# Altium schematic sheet Test_Board_Sch.SchDoc
size A4; SheetNumber: 1; SheetTotal: 1
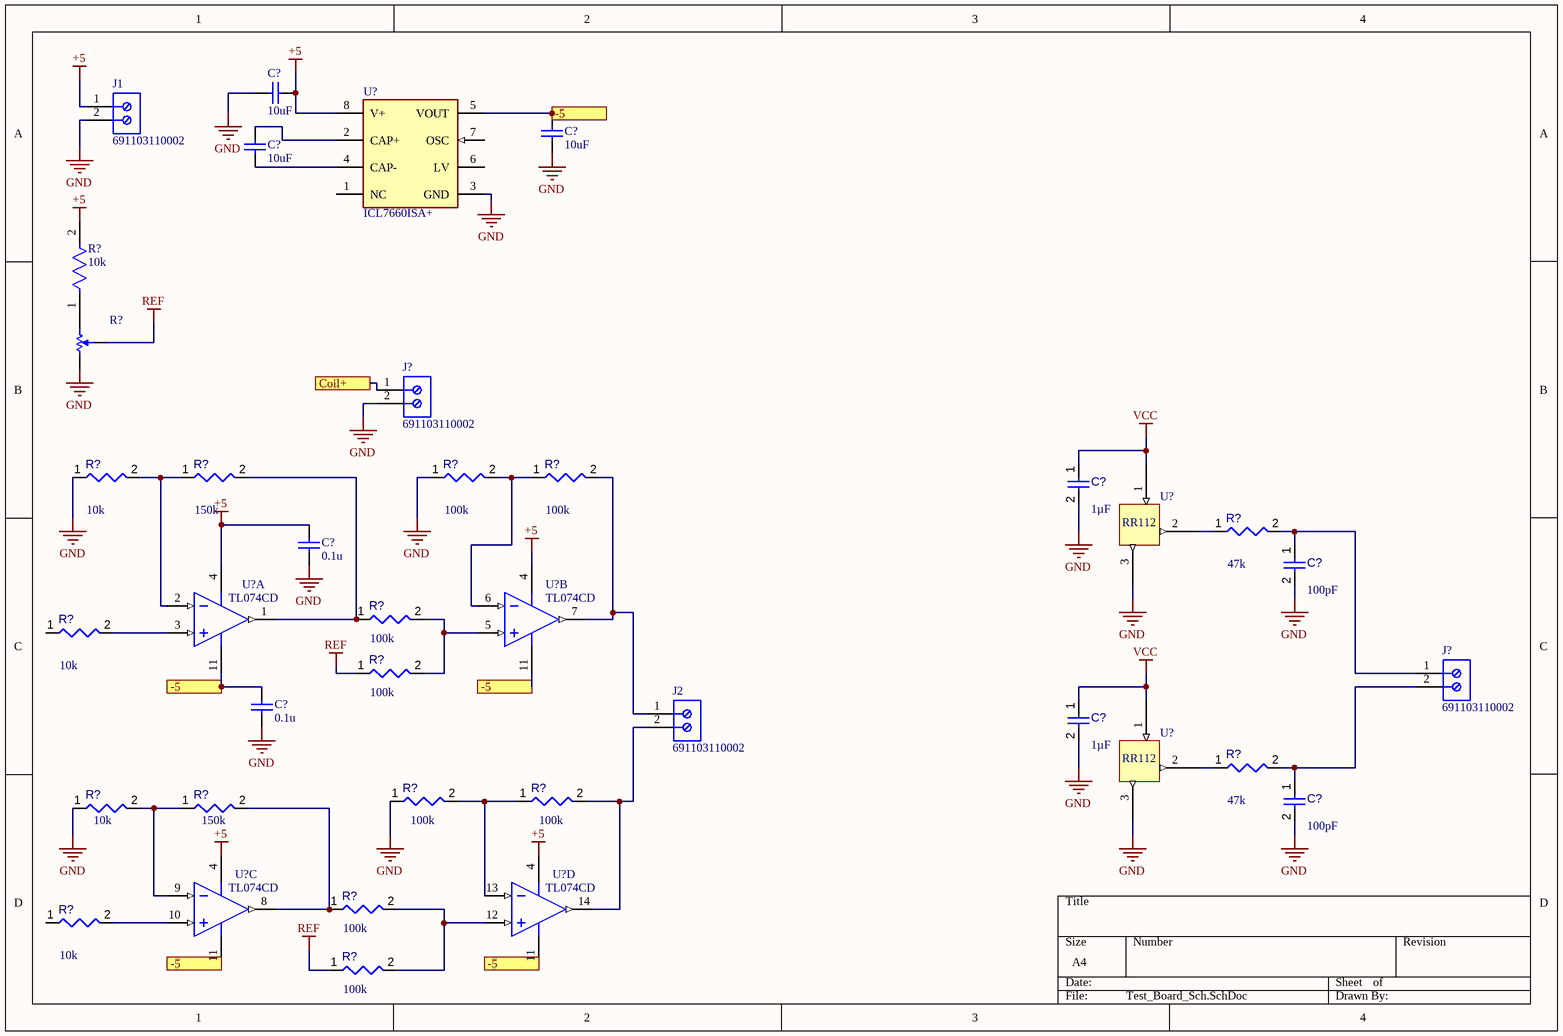
[diagram p0: Test_Board_Sch.SchDoc]

## Parts
(Parts that share a designator on the sheet are numbered #1, #2 ... from top to bottom, then left to right.)
C?#1  10uF  [CAPC2013X88X50LL20T25]
C?#2  10uF  [CAPC2013X88X50LL20T25]
C?#3  10uF  [CAPC2013X88X50LL20T25]
C?#4  value 1µF  [CAPC2013X145X50ML20T25]  (hidden comment: Capacitor 1 uF +/- 10% 25 V 0805)
C?#5  value 100pF  [CAPC2013X145X50ML20T25]  (hidden comment: Capacitor 1 uF +/- 10% 25 V 0805)
C?#6  0.1u  [CAPC2013X88X50LL20T25]
C?#7  value 1µF  [CAPC2013X145X50ML20T25]  (hidden comment: Capacitor 1 uF +/- 10% 25 V 0805)
C?#8  0.1u  [CAPC2013X88X50LL20T25]
C?#9  value 100pF  [CAPC2013X145X50ML20T25]  (hidden comment: Capacitor 1 uF +/- 10% 25 V 0805)
J1  691103110002  [691103110002]
J2  691103110002  [691103110002]
J?#1  691103110002  [691103110002]
J?#2  691103110002  [691103110002]
R?#1  10k  [FP-CR0805-IPC_B]
R?#2  TC33X-2-103E  [BOUR-TC33X-2_V]  (value not drawn)
R?#3  value 10k  [RESC2013X70X40ML20T20]  (hidden comment: Resistor 4k7 +/-1% 0805 125 mW)
R?#4  value 150k  [RESC2013X70X40ML20T20]  (hidden comment: Resistor 4k7 +/-1% 0805 125 mW)
R?#5  value 100k  [RESC2013X70X40ML20T20]  (hidden comment: Resistor 4k7 +/-1% 0805 125 mW)
R?#6  value 100k  [RESC2013X70X40ML20T20]  (hidden comment: Resistor 4k7 +/-1% 0805 125 mW)
R?#7  value 47k  [RESC2013X70X40ML20T20]  (hidden comment: Resistor 4k7 +/-1% 0805 125 mW)
R?#8  value 100k  [RESC2013X70X40ML20T20]  (hidden comment: Resistor 4k7 +/-1% 0805 125 mW)
R?#9  value 10k  [RESC2013X70X40ML20T20]  (hidden comment: Resistor 4k7 +/-1% 0805 125 mW)
R?#10  value 100k  [RESC2013X70X40ML20T20]  (hidden comment: Resistor 4k7 +/-1% 0805 125 mW)
R?#11  value 47k  [RESC2013X70X40ML20T20]  (hidden comment: Resistor 4k7 +/-1% 0805 125 mW)
R?#12  value 100k  [RESC2013X70X40ML20T20]  (hidden comment: Resistor 4k7 +/-1% 0805 125 mW)
R?#13  value 100k  [RESC2013X70X40ML20T20]  (hidden comment: Resistor 4k7 +/-1% 0805 125 mW)
R?#14  value 10k  [RESC2013X70X40ML20T20]  (hidden comment: Resistor 4k7 +/-1% 0805 125 mW)
R?#15  value 150k  [RESC2013X70X40ML20T20]  (hidden comment: Resistor 4k7 +/-1% 0805 125 mW)
R?#16  value 100k  [RESC2013X70X40ML20T20]  (hidden comment: Resistor 4k7 +/-1% 0805 125 mW)
R?#17  value 10k  [RESC2013X70X40ML20T20]  (hidden comment: Resistor 4k7 +/-1% 0805 125 mW)
R?#18  value 100k  [RESC2013X70X40ML20T20]  (hidden comment: Resistor 4k7 +/-1% 0805 125 mW)
U?#1  ICL7660ISA+  [FP-S8-4-MFG]
U?#2  RR112-1G42-531  [SOT145P280X140-3N]  (value not drawn)
U?#3  TL074CD  [D0014A_M]  (part A of 4)
U?#4  TL074CD  [D0014A_M]  (part B of 4)
U?#5  RR112-1G42-531  [SOT145P280X140-3N]  (value not drawn)
U?#6  TL074CD  [D0014A_M]  (part C of 4)
U?#7  TL074CD  [D0014A_M]  (part D of 4)

## Ports
-5, Coil+

## Nets
+5: C?#1.1 C?#6.2 J1.1 R?#1.2 U?#1.8(V+) U?#3.4(VCC+) U?#4.4(VCC+) U?#6.4(VCC+) U?#7.4(VCC+)
GND: C?#1.2 C?#2.1 C?#4.2 C?#5.2 C?#6.1 C?#7.2 C?#8.1 C?#9.2 J1.2 J?#1.2 R?#2.1 R?#3.1 R?#5.1 R?#12.1 R?#14.1 U?#1.3(GND) U?#2.3(GND) U?#5.3(GND)
REF: R?#2.2 R?#10.1 R?#18.1
VCC: C?#4.1 C?#7.1 U?#2.1(Vdd) U?#5.1(Vdd)
-5: C?#2.2 C?#8.2 U?#1.5(VOUT) U?#3.11(VCC-) U?#4.11(VCC-) U?#6.11(VCC-) U?#7.11(VCC-) ; port -5
Coil+: J?#1.1 ; port Coil+
NetC?#3_1: C?#3.1 U?#1.4(CAP-)
NetC?#3_2: C?#3.2 U?#1.2(CAP+)
NetC?#5_1: C?#5.1 J?#2.1 R?#7.2
NetC?#9_1: C?#9.1 J?#2.2 R?#11.2
NetJ2_1: J2.1 R?#6.2 U?#4.7(OUT2)
NetJ2_2: J2.2 R?#13.2 U?#7.14(OUT4)
NetR?#1_1: R?#1.1 R?#2.3
NetR?#3_2: R?#3.2 R?#4.1 U?#3.2(IN1-)
NetR?#4_2: R?#4.2 R?#8.1 U?#3.1(OUT1)
NetR?#5_2: R?#5.2 R?#6.1 U?#4.6(IN2-)
NetR?#7_1: R?#7.1 U?#2.2(Output)
NetR?#8_2: R?#8.2 R?#10.2 U?#4.5(IN2+)
NetR?#9_2: R?#9.2 U?#3.3(IN1+)
NetR?#11_1: R?#11.1 U?#5.2(Output)
NetR?#12_2: R?#12.2 R?#13.1 U?#7.13(IN4-)
NetR?#14_2: R?#14.2 R?#15.1 U?#6.9(IN3-)
NetR?#15_2: R?#15.2 R?#16.1 U?#6.8(OUT3)
NetR?#16_2: R?#16.2 R?#18.2 U?#7.12(IN4+)
NetR?#17_2: R?#17.2 U?#6.10(IN3+)

Not connected (* = marked no-connect by the designer): R?#9 1; R?#17 1; U?#1 1(NC) 6(LV) 7(OSC)

## Notes on the sheet
- (in symbol CMP-010-0002465-1) RR112

## Library data of the parts
C?#1-C?#3 C?#6 C?#8 = CMP-2007-00266-1: Manufacturer: Kemet; Part Number: C0805C103K5RACTU
C?#4 C?#5 C?#7 C?#9 = CMP-001-00010-6: Chip Capacitor, 1 uF, +/-10%, 25 V, 0805 (2012 Metric); Capacitor Type: Ceramic; Voltage Rating: 25V; RoHS Compliant: True; Pins: 2; Mounting Technology: SM; Max Operating Temperature: 125°C; Min Operating Temperature: -55°C; Tolerance: 10%; Case/Package: 0805
J1 J2 J?#1 J?#2 = CMP-1502-03254-1: Series 1031 - 3.50 mm Horizontal Entry Modular with Pressure Clamp WR-TBL, 2 pin; Manufacturer: Wurth Elektronik; Pin Number: 2; Pitch: 3.50mm; Datasheet URL: http://katalog.we-online.de/em/datasheet/6911031100xx.pdf; Package Reference: 691103110002; Publisher: WurthElektronik; Manufacturer URL: http://www.we-online.de; Mounting Technology: THT; Operating Temperature: -40to105degC; Part Number: 691103110002; Packaging: Box
R?#1 = CMP-07231-003873-1: Thick Film Chip Resistors 0805 10kΩ 0.125W 5% 200ppm/°C; Resistance: 10kR; Power Rating: 125mW; Voltage Rating (DC): 100V; Voltage Rating: 150V; Width: 1.25mm; Composition: Thick Film; Packaging: Tape and Reel; Number of Terminations: 2; Min Operating Temperature: -55°C; Height: 0.5mm; Temperature Coefficient: 200ppm/°C; Features: Moisture Resistant; Termination: SMD/SMT; Case Code (Imperial): 0805; Package Quantity: 1; Radiation Hardening: No; Military Standard: Not; Thickness: 508um; Depth: 1.25mm; Tolerance: 5%; Contact Plating: Tin; Number of Pins: 2; Length: 2mm; Max Power Dissipation: 125mW; Mount: Surface Mount; Case Code (Metric): 2012; Case/Package: 0805; REACH SVHC: No SVHC; Max Operating Temperature: 155°C
R?#2 = CMP-009-00060-2: Trimming Potentiometer, 10000 Ohm, -40 to 100 degC, 3-Pin SMD, RoHS, Tape and Reel; Manufacturer: Bourns; Tolerance: 25%; Power: 100mW; Resistance: 10k; Max Operating Temperature: 120°C; Package Description: 3-Pin Surface Mount Device, Body 3.8 x 3.6 mm; Datasheet Version: Aug-16; RoHS Compliant: True; Mounting Technology: SM; Package Quantity: 2500; Manufacturer URL: http://www.bourns.com/; Datasheet URL: http://www.bourns.com/docs/Product-Datasheets/TC33.pdf; Case/Package: TC33X-2; Package Reference: TC33X-2; Composition: Potentiometer; Packaging: TapeandReel; Min Operating Temperature: -40°C
R?#3-R?#18 = CMP-009-00032-5: Chip Resistor, 4.7 KOhm, +/- 1%, 0.125 W, -55 to 155 degC, 0805 (2012 Metric); Power: 125mW; Voltage Rating: 150V; Max Operating Temperature: 155°C; Min Operating Temperature: -55°C; Case/Package: 0805; RoHS Compliant: True; Pins: 2; Tolerance: 1%; Mounting Technology: SM
U?#1 = CMP-05722-000006-1: IC REG CHARG PUMP INV 20MA 8SOIC; Manufacturer: Maxim; Nominal Supply Current: 80uA; Standoff Height: 0.1mm; Description: Charge Pump Switching Regulator IC Positive or Negative Fixed -Vin, nVin, Vin/2 1 Output 20mA 8-SOIC (0.154", 3.90mm Width); Output Voltage: -10/+20V; Max Power Dissipation: 471mW; Max Supply Voltage: 10V; Negative Voltage Available: true; Output Type: Other; Switching Frequency: 10kHz; Number Of Outputs: 1; Min Supply Voltage: 1.5V; Switching Topology: Charge Pump; Temperature: -20°C to +85°C; Automotive: No; Mouser Description: Switching Voltage Regulators Switched-Capacitor Voltage Converter; Manufacturer Part Number: ICL7660ISA+; Temperature Range High: +85°C; Octopart: https://octopart.com/icl7660isa%2B-maxim+integrated-39621870; Temperature Range Low: -20°C; Digikey Description: IC REG CHARG PUMP INV 20MA 8SOIC; ComponentLink2URL: https://datasheets.maximintegrated.com/en/ds/ICL7660-MAX1044.pdf; Device Class L3: Voltage Regulators - Switching; Device Class L2: Power Management ICs; ComponentLink2Description: Datasheet; Height: 1.75mm; RoHS: TRUE; Output Current: 20mA; Package: S8-4; Device Class L1: Integrated Circuits (ICs); Footprint Url: https://pdfserv.maximintegrated.com/land_patterns/90-0096.PDF; Category: IC; Lead Free: Yes
U?#2 U?#5 = CMP-010-0002465-1: TMR Sensor
U?#3 U?#4 U?#6 U?#7 = CMP-0017-00005-2: Quad Low-Noise JFET-Input General-Purpose Operational Amplifier, 7 to 36 V, 0 to 70 degC, 14-pin SOIC (D14), Green (RoHS & no Sb/Br); Manufacturer: Texas Instruments; Iq per channel(Max)(mA): 2.5; CMRR(Min)(dB): 70; Offset Drift(Typ)(uV/C): 18; Slew Rate(Typ)(V/us): 13; Rating: Military; Number of Channels: 4; Total Supply Voltage(Min)(+5V is 5, +/-5V is 10): 7; Sub Family: General Purpose Amplifier, High Supply Voltage Amplifier (>=30V); IIB(Max)(pA): 200; Total Supply Voltage(Max)(+5V is 5, +/-5V is 10): 36; Vio (25C)(Max)(mV): 10; GBW(Typ)(MHz): 3; ComponentLink1Description: Manufacturer URL; ComponentLink2Description: Datasheet; PackageDescription: 14-Pin Plastic Small Outline, Body 8.65 x 3.90 mm, Pitch 1.27 mm; Mounting Technology: Surface Mount; ComponentLink2URL: http://www.ti.com/lit/ds/symlink/tl074.pdf; PartNumber: TL074CD; Vn at 1kHz(Typ)(nV/rtHz): 18; Eco-Plan: Green (RoHS & no Sb/Br); ComponentLink1URL: http://www.ti.com/; PackageVersion: 4040047-5/M, 06/2011; ComponentLink3Description: Package Specification; DatasheetVersion: SLOS080J; Code_JEDEC: MS-012; PackageReference: D0014A; ComponentLink3URL: http://www.ti.com/lit/ml/mpds177g/mpds177g.pdf